# EAGLE design rc-light-controller-tlc5940-smd (EAGLE 6.5.0)
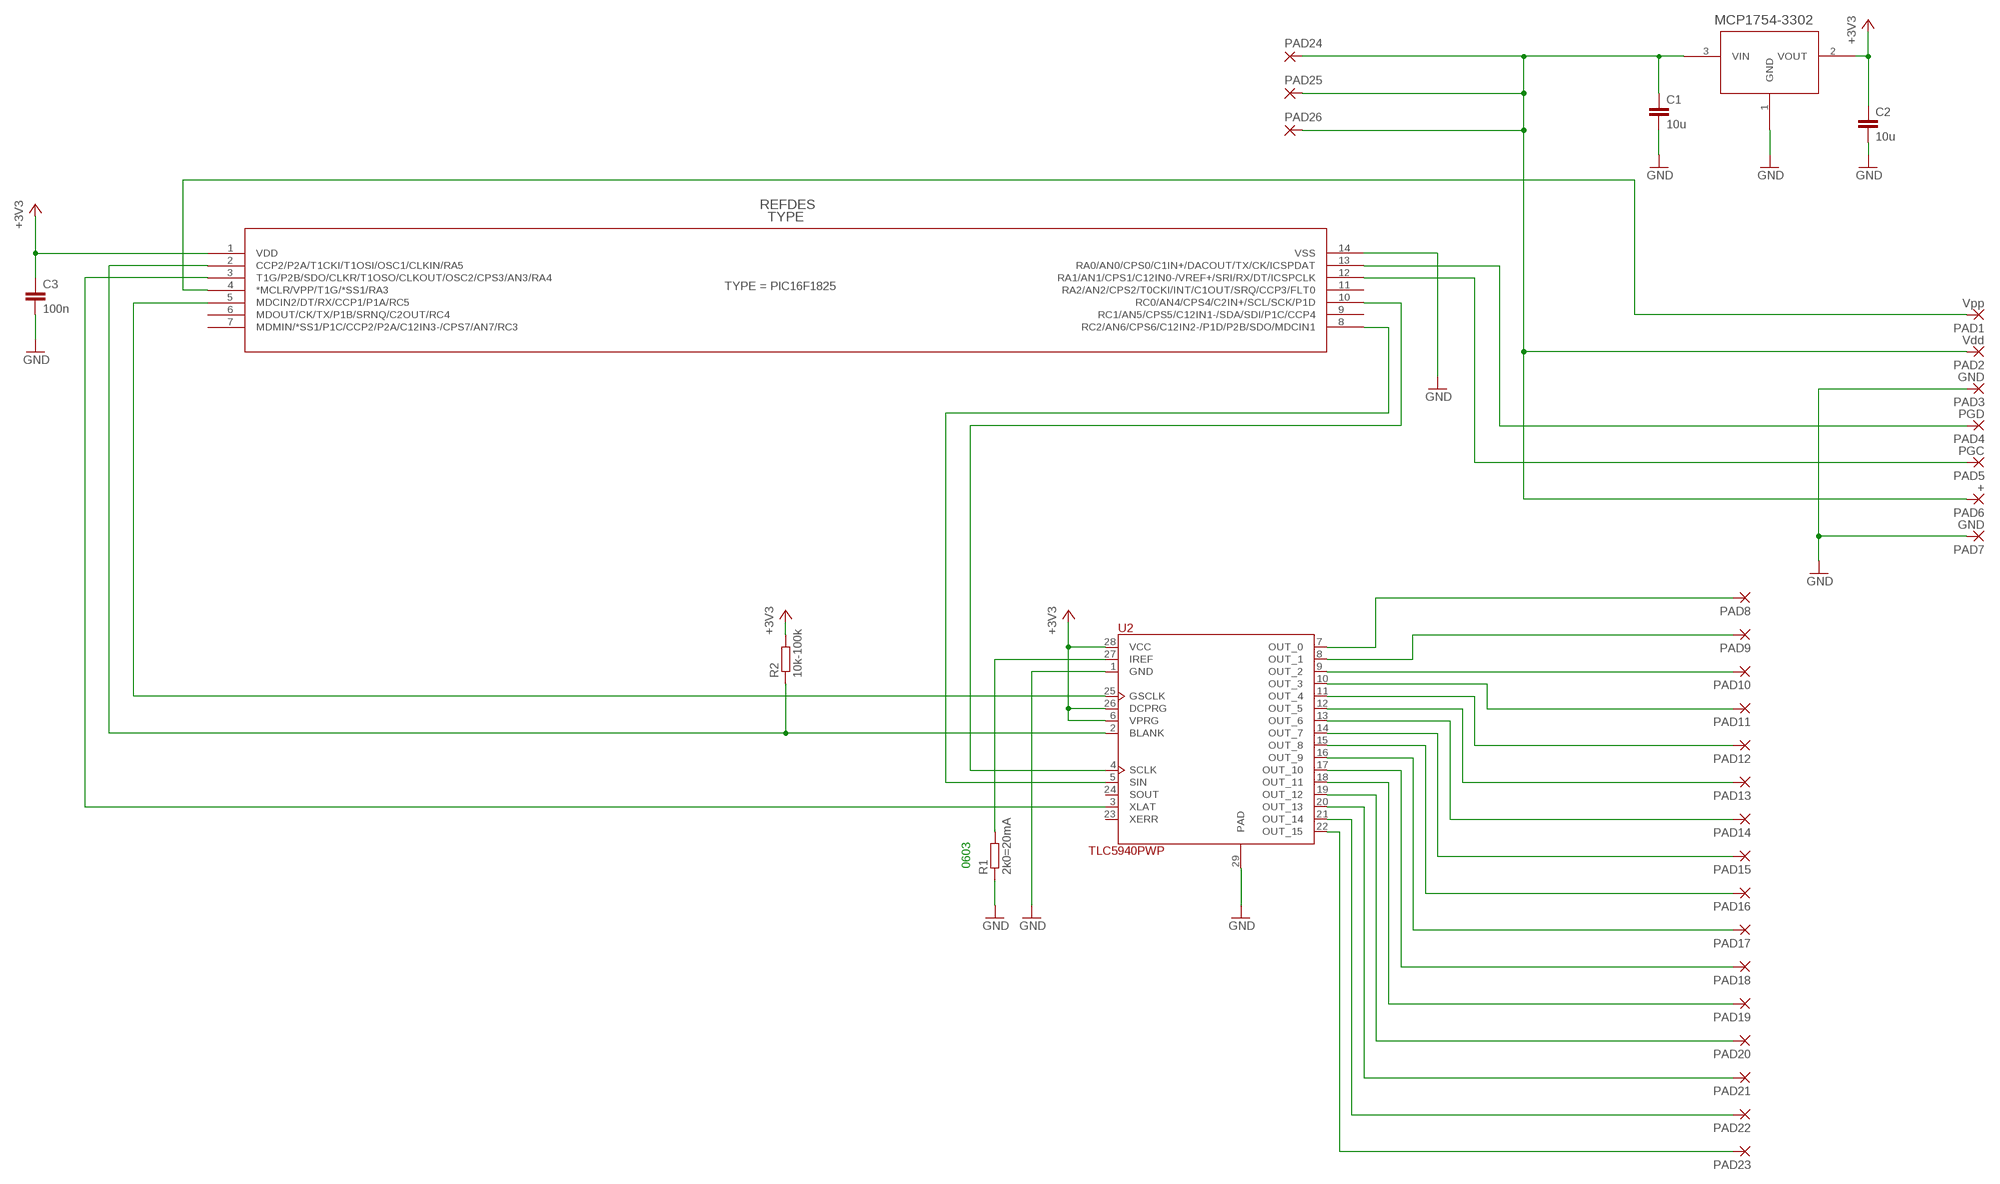
[diagram p0: schematic, sheet 1, part 1 of 2]
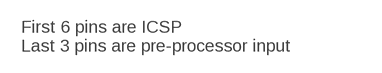
[diagram p1: schematic, sheet 1, part 2 of 2]

## Parts
C1  10u  C-EUC0805  [C0805]
C2  10u  C-EUC0805  [C0805]
C3  100n  C-EUC0805  [C0805]
PAD1  Vpp  SDM80X120  [SMD80X120]
PAD2  Vdd  SDM80X120  [SMD80X120]
PAD3  GND  SDM80X120  [SMD80X120]
PAD4  PGD  SDM80X120  [SMD80X120]
PAD5  PGC  SDM80X120  [SMD80X120]
PAD6  +  SDM80X120  [SMD80X120]
PAD7  GND  SDM80X120  [SMD80X120]
PAD8  SMD50X100  [SMD50X100]
PAD9  SMD50X100  [SMD50X100]
PAD10  SMD50X100  [SMD50X100]
PAD11  SMD50X100  [SMD50X100]
PAD12  SMD50X100  [SMD50X100]
PAD13  SMD50X100  [SMD50X100]
PAD14  SMD50X100  [SMD50X100]
PAD15  SMD50X100  [SMD50X100]
PAD16  SMD50X100  [SMD50X100]
PAD17  SMD50X100  [SMD50X100]
PAD18  SMD50X100  [SMD50X100]
PAD19  SMD50X100  [SMD50X100]
PAD20  SMD50X100  [SMD50X100]
PAD21  SMD50X100  [SMD50X100]
PAD22  SMD50X100  [SMD50X100]
PAD23  SMD50X100  [SMD50X100]
PAD24  SMD50X100  [SMD50X100]
PAD25  SMD50X100  [SMD50X100]
PAD26  SMD50X100  [SMD50X100]
R1  2k0=20mA  R-EU_R0805  [R0805]
R2  10k-100k  R-EU_R0805  [R0805]
U1  PIC16F1825-X_SL  [SOIC14-N_MC]
U2  TLC5940PWP  [SOP65P640X120-29N]
U$1  MCP1754X-XXXXX/C  [SOT-23A_MC]

## Nets
+3V3: C2.1 C3.1 R2.2 U1.1(VDD) U2.6(VPRG) U2.26(DCPRG) U2.28(VCC) U$1.2(VOUT)
BLANK: R2.1 U1.2(CCP2/P2A/T1CKI/T1OSI/OSC1/CLKIN/RA5) U2.2(BLANK)
CH3/VPP: PAD1.1(P) U1.4(*MCLR/VPP/T1G/*SS1/RA3)
GND: C1.2 C2.2 C3.2 PAD3.1(P) PAD7.1(P) R1.1 U1.14(VSS) U2.1(GND) U2.29(PAD) U$1.1(GND)
GSCLK: U1.5(MDCIN2/DT/RX/CCP1/P1A/RC5) U2.25(GSCLK)
IREF: R1.2 U2.27(IREF)
N$1: PAD8.1(P) U2.7(OUT_0)
N$2: PAD9.1(P) U2.8(OUT_1)
N$3: PAD10.1(P) U2.9(OUT_2)
N$4: PAD11.1(P) U2.10(OUT_3)
N$5: PAD23.1(P) U2.22(OUT_15)
N$6: PAD22.1(P) U2.21(OUT_14)
N$7: PAD21.1(P) U2.20(OUT_13)
N$8: PAD20.1(P) U2.19(OUT_12)
N$9: PAD19.1(P) U2.18(OUT_11)
N$10: PAD18.1(P) U2.17(OUT_10)
N$11: PAD17.1(P) U2.16(OUT_9)
N$12: PAD16.1(P) U2.15(OUT_8)
N$13: PAD15.1(P) U2.14(OUT_7)
N$14: PAD14.1(P) U2.13(OUT_6)
N$15: PAD13.1(P) U2.12(OUT_5)
N$16: PAD12.1(P) U2.11(OUT_4)
SCLK: U1.10(RC0/AN4/CPS4/C2IN+/SCL/SCK/P1D) U2.4(SCLK)
SIN: U1.8(RC2/AN6/CPS6/C12IN2-/P1D/P2B/SDO/MDCIN1) U2.5(SIN)
SLAT: U1.3(T1G/P2B/SDO/CLKR/T1OSO/CLKOUT/OSC2/CPS3/AN3/RA4) U2.3(XLAT)
ST/CLK/RX: PAD5.1(P) U1.12(RA1/AN1/CPS1/C12IN0-/VREF+/SRI/RX/DT/ICSPCLK)
TH/DAT/TX: PAD4.1(P) U1.13(RA0/AN0/CPS0/C1IN+/DACOUT/TX/CK/ICSPDAT)
VIN: C1.1 PAD2.1(P) PAD6.1(P) PAD24.1(P) PAD25.1(P) PAD26.1(P) U$1.3(VIN)
Unconnected: U1.6(MDOUT/CK/TX/P1B/SRNQ/C2OUT/RC4) U1.7(MDMIN/*SS1/P1C/CCP2/P2A/C12IN3-/CPS7/AN7/RC3) U1.9(RC1/AN5/CPS5/C12IN1-/SDA/SDI/P1C/CCP4) U1.11(RA2/AN2/CPS2/T0CKI/INT/C1OUT/SRQ/CCP3/FLT0) U2.23(XERR) U2.24(SOUT)

## Notes on the sheet
- First 6 pins are ICSP
  Last 3 pins are pre-processor input
- 0603

## Library data of the parts
C1-C3 = rcl:C-EU: CAPACITOR, European symbol
PAD1-PAD7 = wirepad:SDM80X120
PAD8-PAD26 = wirepad:SMD50X100: SMD PAD
R1 R2 = rcl:R-EU_: RESISTOR, European symbol
U1 = PIC16F1825:PIC16F1825-X_SL; TYPE: PIC16F1825
U2 = tlc5940:TLC5940: 16 CHANNEL LED DRIVER WITH DOT CORRECTION AND GRAYSCALE PWM CONTROL; MPN: TLC5940PWP; PACKAGE: HTSSOP-28; SUPPLIER: Texas Instruments
U$1 = MCP1754:MCP1754X-XXXXX/C

## Board
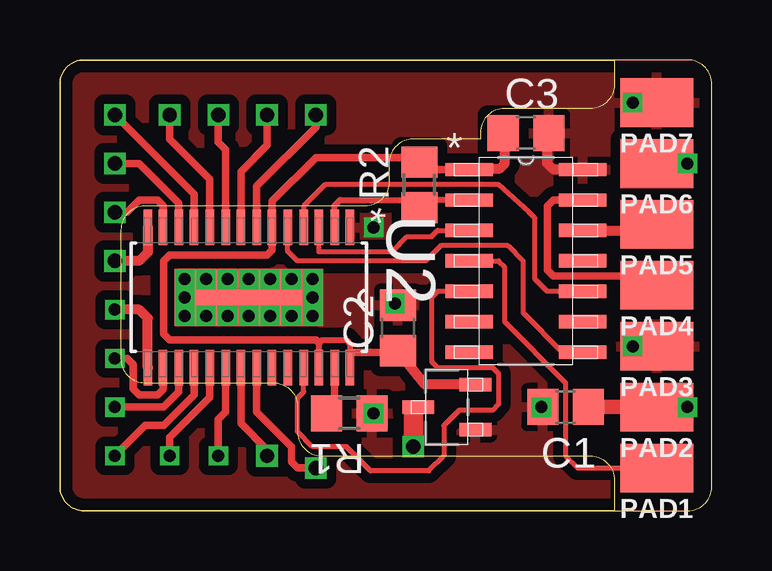
[diagram p2: board, top side]
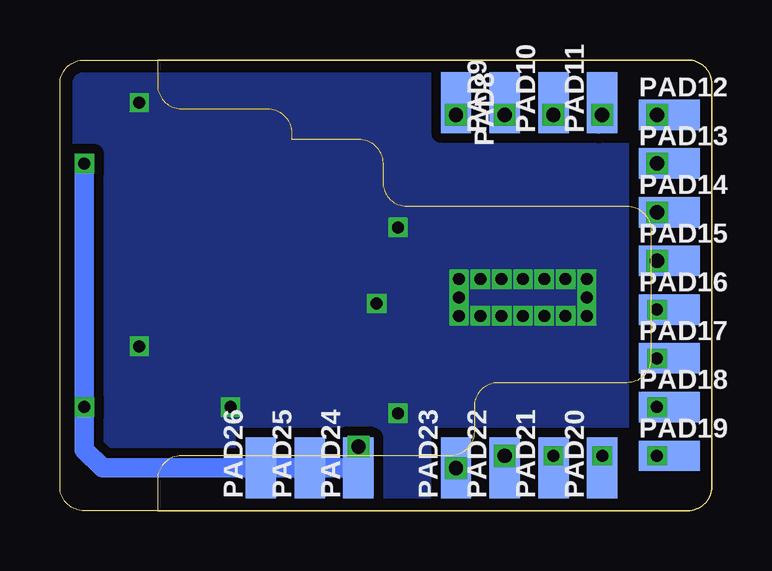
[diagram p3: board, bottom side, seen from below]

Size 27.18 x 18.8 mm. Coordinates in mm from the lower left corner, seen from the top.
Outline: 26.18,18.8 1,18.8 arc90 0,17.8 0,1 arc90 1,0 26.18,0 arc90 27.18,1 27.18,17.8 arc90 26.18,18.8
Copper layers (1*16): Top 0.035mm / dielectric 1.5mm / Bottom 0.035mm
Design rules "smart-prototyping": minimum track width 7mil, minimum drill 12mil, track to track 7mil, track to pad 7mil, pad to pad 7mil, via to via 7mil, smd to smd 0mil, copper to edge 20mil, drill to drill 10mil, minimum pad ring 10mil, minimum via ring 6mil, stop-mask expansion 2mil, vias tented up to drill 25mil, thermal gap 10mil
Milling: 25 lines

### Footprints (pad centres in the part's own frame; a part is rotated, then mirrored left to right if it is on the bottom)
C0805 = smd 1.3 x 1.5: 1 -0.95,0; 2 0.95,0
SMD80X120 = smd 2.032 x 3.048: 1 0,0
SMD50X100 = smd 1.27 x 2.54: 1 0,0
R0805 = smd 1.3 x 1.5: 1 -0.95,0; 2 0.95,0
SOIC14-N_MC = smd 1.981 x 0.559: 1 -2.362,3.81; 2 -2.362,2.54; 3 -2.362,1.27; 4 -2.362,0; 5 -2.362,-1.27; 6 -2.362,-2.54; 7 -2.362,-3.81; 8 2.362,-3.81; 9 2.362,-2.54; 10 2.362,-1.27; 11 2.362,0; 12 2.362,1.27; 13 2.362,2.54; 14 2.362,3.81
SOP65P640X120-29N = smd 1.473 x 0.356: 1 -2.921,4.216; 2 -2.921,3.581; 3 -2.921,2.921; 4 -2.921,2.286; 5 -2.921,1.626; 6 -2.921,0.965; 7 -2.921,0.33; 8 -2.921,-0.33; 9 -2.921,-0.965; 10 -2.921,-1.626; 11 -2.921,-2.286; 12 -2.921,-2.921; 13 -2.921,-3.581; 14 -2.921,-4.216; 15 2.921,-4.216; 16 2.921,-3.581; 17 2.921,-2.921; 18 2.921,-2.286; 19 2.921,-1.626; 20 2.921,-0.965; 21 2.921,-0.33; 22 2.921,0.33; 23 2.921,0.965; 24 2.921,1.626; 25 2.921,2.286; 26 2.921,2.921; 27 2.921,3.581; 28 2.921,4.216 | smd 2.388 x 6.172: 29 0,0
SOT-23A_MC = smd 0.559 x 1.321: 1 -0.94,-1.194; 2 0.94,-1.194; 3 0,1.194

### Placement (x,y rotation side)
C1  21.08,4.32 180 top
C2  14.1,7.62 90 top
C3  19.43,15.75 0 top
PAD1  24.89,1.78 90 top
PAD2  24.89,4.32 90 top
PAD3  24.89,6.86 90 top
PAD4  24.89,9.4 90 top
PAD5  24.89,11.94 90 top
PAD6  24.89,14.48 90 top
PAD7  24.89,17.02 90 top
PAD8  10.67,17.02 180 bottom
PAD9  8.64,17.02 0 bottom
PAD10  6.6,17.02 0 bottom
PAD11  4.57,17.02 0 bottom
PAD12  1.78,16.51 270 bottom
PAD13  1.78,14.48 270 bottom
PAD14  1.78,12.45 270 bottom
PAD15  1.78,10.41 270 bottom
PAD16  1.78,8.38 270 bottom
PAD17  1.78,6.35 270 bottom
PAD18  1.78,4.32 270 bottom
PAD19  1.78,2.29 270 bottom
PAD20  4.57,1.78 0 bottom
PAD21  6.6,1.78 0 bottom
PAD22  8.64,1.78 0 bottom
PAD23  10.67,1.78 0 bottom
PAD24  14.73,1.78 0 bottom
PAD25  16.76,1.78 0 bottom
PAD26  18.8,1.78 0 bottom
R1  12.06,4.06 180 top
R2  14.99,13.59 90 top
U1  19.43,10.41 0 top
U2  7.87,8.89 270 top
U$1  16.13,4.32 90 top

### Tracks (layer width: path | path; a pad name or v marks a point on that pad's centre or on a via)
+3V3
  Top 0.254: U2.26 10.79,6.99 10.92,7.11 11.94,7.11 12.09,6.96 12.09,6.6 U2.28
  Top 0.305: 17.02,14.28 U1.1 14.92,14.22 R2.2 14.99,14.73 10.67,14.73 8.84,12.9 U2.6 8.84,10.87 8.64,10.67 4.57,10.67 4.32,10.41 4.32,7.37 4.57,7.11 10.67,7.11 10.79,6.99 | C2.1 13.8,6.6 12.09,6.6
  Top 0.406: U$1.2 15.23,5.26 C2.1 | 17.02,14.28 18.34,14.28 18.54,14.48 18.54,15.71 C3.1
BLANK
  Top 0.254: U1.2 14.67,12.95 arc90 R2.1 14.99,12.95 11.68,12.95 11.46,12.72 U2.2
CH3/VPP
  Top 0.203: U1.4 18.29,10.41 18.54,10.16 18.54,7.87 21.08,5.33 21.08,2.29 21.59,1.78 PAD1.1
GND  (via drill 0.5)
  Top 0.305: PAD7.1 v23.88,17.02 | 12.09,12.19 U2.1
  Top 0.406: v13.97,8.64 13.97,8.6 C2.2 | R1.1 v13.08,4.06 | v7.87,8.13 U2.29 | v23.88,6.86 PAD3.1 | U1.14 20.57,14.22 20.32,14.48 20.32,15.71 C3.2
  other vias: 6.1,9.65 5.21,9.65 6.99,9.65 7.87,9.65 9.65,9.65 10.54,9.65 10.54,8.13 8.76,8.13 5.21,8.13 13.08,11.81 8.76,9.65 6.1,8.13 9.65,8.13 6.99,8.13 5.21,8.89 10.54,8.89 20.07,4.32
  pour Bottom (isolate 0.406): 0,18.54 26.92,18.54 26.92,0 0,0
  pour Top (isolate 0.406): 0,18.8 27.18,18.8 27.18,0 0,0
GSCLK
  Top 0.203: U1.5 15.75,9.14 15.49,8.89 15.49,6.22 15.75,5.97 18.03,5.97 18.29,5.71 18.29,4.45 18.03,4.19 16.64,4.19 16,3.56 16,2.29 15.37,1.65 12.95,1.65 11.94,2.67 10.54,2.67 9.91,3.3 9.91,4.7 10.16,4.95 U2.25
IREF
  Top 0.305: U2.27 11.46,4.53 R1.2
N$1  (via drill 0.6)
  Top 0.305: U2.7 8.2,13.54 10.67,16 v10.67,16.51
  Bottom 0.305: v10.67,16.51 PAD8.1
N$2  (via drill 0.6)
  Top 0.305: U2.8 7.54,14.15 8.64,15.24 v8.64,16.51
  Bottom 0.305: v8.64,16.51 PAD9.1
N$3  (via drill 0.6)
  Top 0.305: U2.9 6.91,15.06 6.6,15.37 v6.6,16.51
  Bottom 0.305: v6.6,16.51 PAD10.1
N$4  (via drill 0.6)
  Top 0.305: U2.10 6.25,13.82 4.57,15.49 v4.57,16.51
  Bottom 0.305: PAD11.1 4.7,15.88 v4.57,16.51
N$5  (via drill 0.6)
  Top 0.305: U2.22 8.2,4.12 9.65,2.67 9.65,2.03 9.91,1.78 PAD23.1
  other vias: 10.67,1.78
N$6  (via drill 0.6)
  Top 0.305: U2.21 7.54,3.63 8.64,2.54 v8.64,2.29
  Bottom 0.305: v8.64,2.29 PAD22.1
N$7  (via drill 0.5)
  Top 0.305: U2.20 6.91,4.12 6.6,3.81 v6.6,2.29
  Bottom 0.305: v6.6,2.29 PAD21.1
N$8  (via drill 0.5)
  Top 0.305: U2.19 6.25,4.72 4.57,3.05 v4.57,2.29
  Bottom 0.305: v4.57,2.29 PAD20.1
N$9  (via drill 0.5)
  Top 0.305: U2.18 5.59,4.83 4.32,3.56 3.56,3.56 v2.29,2.29
  Bottom 0.305: v2.29,2.29 PAD19.1
N$10  (via drill 0.5)
  Top 0.305: U2.17 4.95,4.95 4.32,4.32 v2.29,4.32
  Bottom 0.305: v2.29,4.32 PAD18.1
N$11  (via drill 0.5)
  Top 0.305: U2.16 4.29,5.05 4.06,4.83 3.3,4.83 3.05,5.08 3.05,6.1 2.79,6.35 v2.29,6.35
  Bottom 0.305: v2.29,6.35 PAD17.1
N$12  (via drill 0.5)
  Top 0.406: U2.15 3.66,8.03 3.3,8.38 v2.29,8.38
  Bottom 0.406: v2.29,8.38 PAD16.1
N$13  (via drill 0.6)
  Top 0.406: U2.14 3.66,10.77 3.3,10.41 v2.29,10.41
  Bottom 0.406: v2.29,10.41 PAD15.1
N$14  (via drill 0.6)
  Top 0.305: U2.13 4.29,12.72 4.06,12.95 3.3,12.95 2.79,12.45 v2.29,12.45
  Bottom 0.305: v2.29,12.45 PAD14.1
N$15  (via drill 0.6)
  Top 0.305: U2.12 4.95,12.83 3.3,14.48 v2.29,14.48
  Bottom 0.305: v2.29,14.48 PAD13.1
N$16  (via drill 0.6)
  Top 0.305: U2.11 5.59,13.21 v2.29,16.51
  Bottom 0.305: v2.29,16.51 PAD12.1
SCLK
  Top 0.203: U1.10 20.32,9.14 19.81,9.65 19.81,12.19 19.56,12.45 18.29,13.59 11.05,13.59 10.16,12.7 U2.4
SIN
  Top 0.203: U1.8 20.95,6.6 19.3,8.26 19.3,10.41 18.67,11.05 15.88,11.05 15.24,10.41 9.91,10.41 9.5,10.82 U2.5
SLAT
  Top 0.203: U2.3 10.79,10.79 13.84,10.79 14.48,11.43 15.49,11.43 15.75,11.68 U1.3
ST/CLK/RX
  Top 0.406: U1.12 24.89,11.68 PAD5.1
TH/DAT/TX
  Top 0.203: 23.5,9.78 23.5,9.65
  Top 0.254: 23.5,9.65 23.75,9.4 PAD4.1
  Top 0.305: U1.13 20.57,12.95 20.32,12.7 20.32,10.03 20.57,9.78 23.5,9.78
VIN  (via drill 0.5, 0.6)
  Top 0.406: U$1.3 14.73,4.12
  Top 0.61: PAD2.1 C1.1
  Top 0.813: PAD2.1 v26.16,4.32 | v26.16,14.48 PAD6.1 | 14.73,4.12 v14.73,2.67
  Bottom 0.813: v26.16,14.48 v26.16,4.32 26.16,2.54 25.4,1.78 PAD26.1 PAD25.1 PAD24.1 v14.73,2.67

### Text on the board
tValues: PIC16F1825 | 3V3
bValues: Rev. 4 | 4 | ICSP | * | 3 | 2 | 1 | 0 | 6 | LANE Boys RC | Rx / (ST) | * | 7 | Tx / (TH) | 8 | 9 | RC Light Controller | 12 | 13 | 14 | 15 | +LED | + | (CH3)